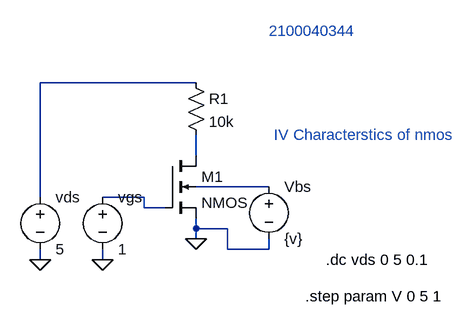
[diagram p0: schematic IV Characterstics of nmos.asc]
IV Characterstics of nmos.asc, the LTspice schematic file:
Version 4
SHEET 1 880 680
WIRE 192 48 -48 48
WIRE 192 160 192 128
WIRE 304 208 192 208
WIRE -48 224 -48 48
WIRE 112 224 48 224
WIRE 112 240 112 224
WIRE 144 240 112 240
WIRE 192 272 192 256
WIRE 240 272 192 272
WIRE 192 288 192 272
WIRE 240 304 240 272
WIRE 304 304 304 288
WIRE 304 304 240 304
WIRE -48 320 -48 304
WIRE 48 320 48 304
FLAG -48 320 0
FLAG 48 320 0
FLAG 192 288 0
SYMBOL voltage 48 208 R0
WINDOW 123 0 0 Left 0
WINDOW 39 0 0 Left 0
SYMATTR InstName vgs
SYMATTR Value 1
SYMBOL voltage -48 208 R0
WINDOW 123 0 0 Left 0
WINDOW 39 0 0 Left 0
SYMATTR InstName vds
SYMATTR Value 5
SYMBOL res 176 32 R0
SYMATTR InstName R1
SYMATTR Value 10k
SYMBOL nmos4 144 160 R0
SYMATTR InstName M1
SYMBOL voltage 304 192 R0
SYMATTR InstName Vbs
SYMATTR Value {v}
TEXT 312 128 Left 2 ;IV Characterstics of nmos
TEXT 392 320 Left 2 !.dc vds 0 5 0.1
TEXT 360 376 Left 2 !.step param V 0 5 1
TEXT 304 -32 Left 2 ;2100040344

The netlist it stands for:
* IV Characterstics of nmos.asc
vgs N004 0 1
vds N001 0 5
R1 N001 N002 10k
M1 N002 N004 0 N003 NMOS
Vbs N003 0 {v}
.model NMOS NMOS
.model PMOS PMOS
.lib standard.mos
* IV Characterstics of nmos
.dc vds 0 5 0.1
.step param V 0 5 1
* 2100040344
.backanno
.end